# EasyEDA Pro project ESD_System.eprj, schematic Schematic2
Board Name: Base_Board; Create Date: 2026-06-29; Page Name: P1; Project Name: ESD_System; Schematic Name: Schematic2; Update Date: 2026-07-01; Company: EasyEDA.com; Page Size: A4; Version: V1.0
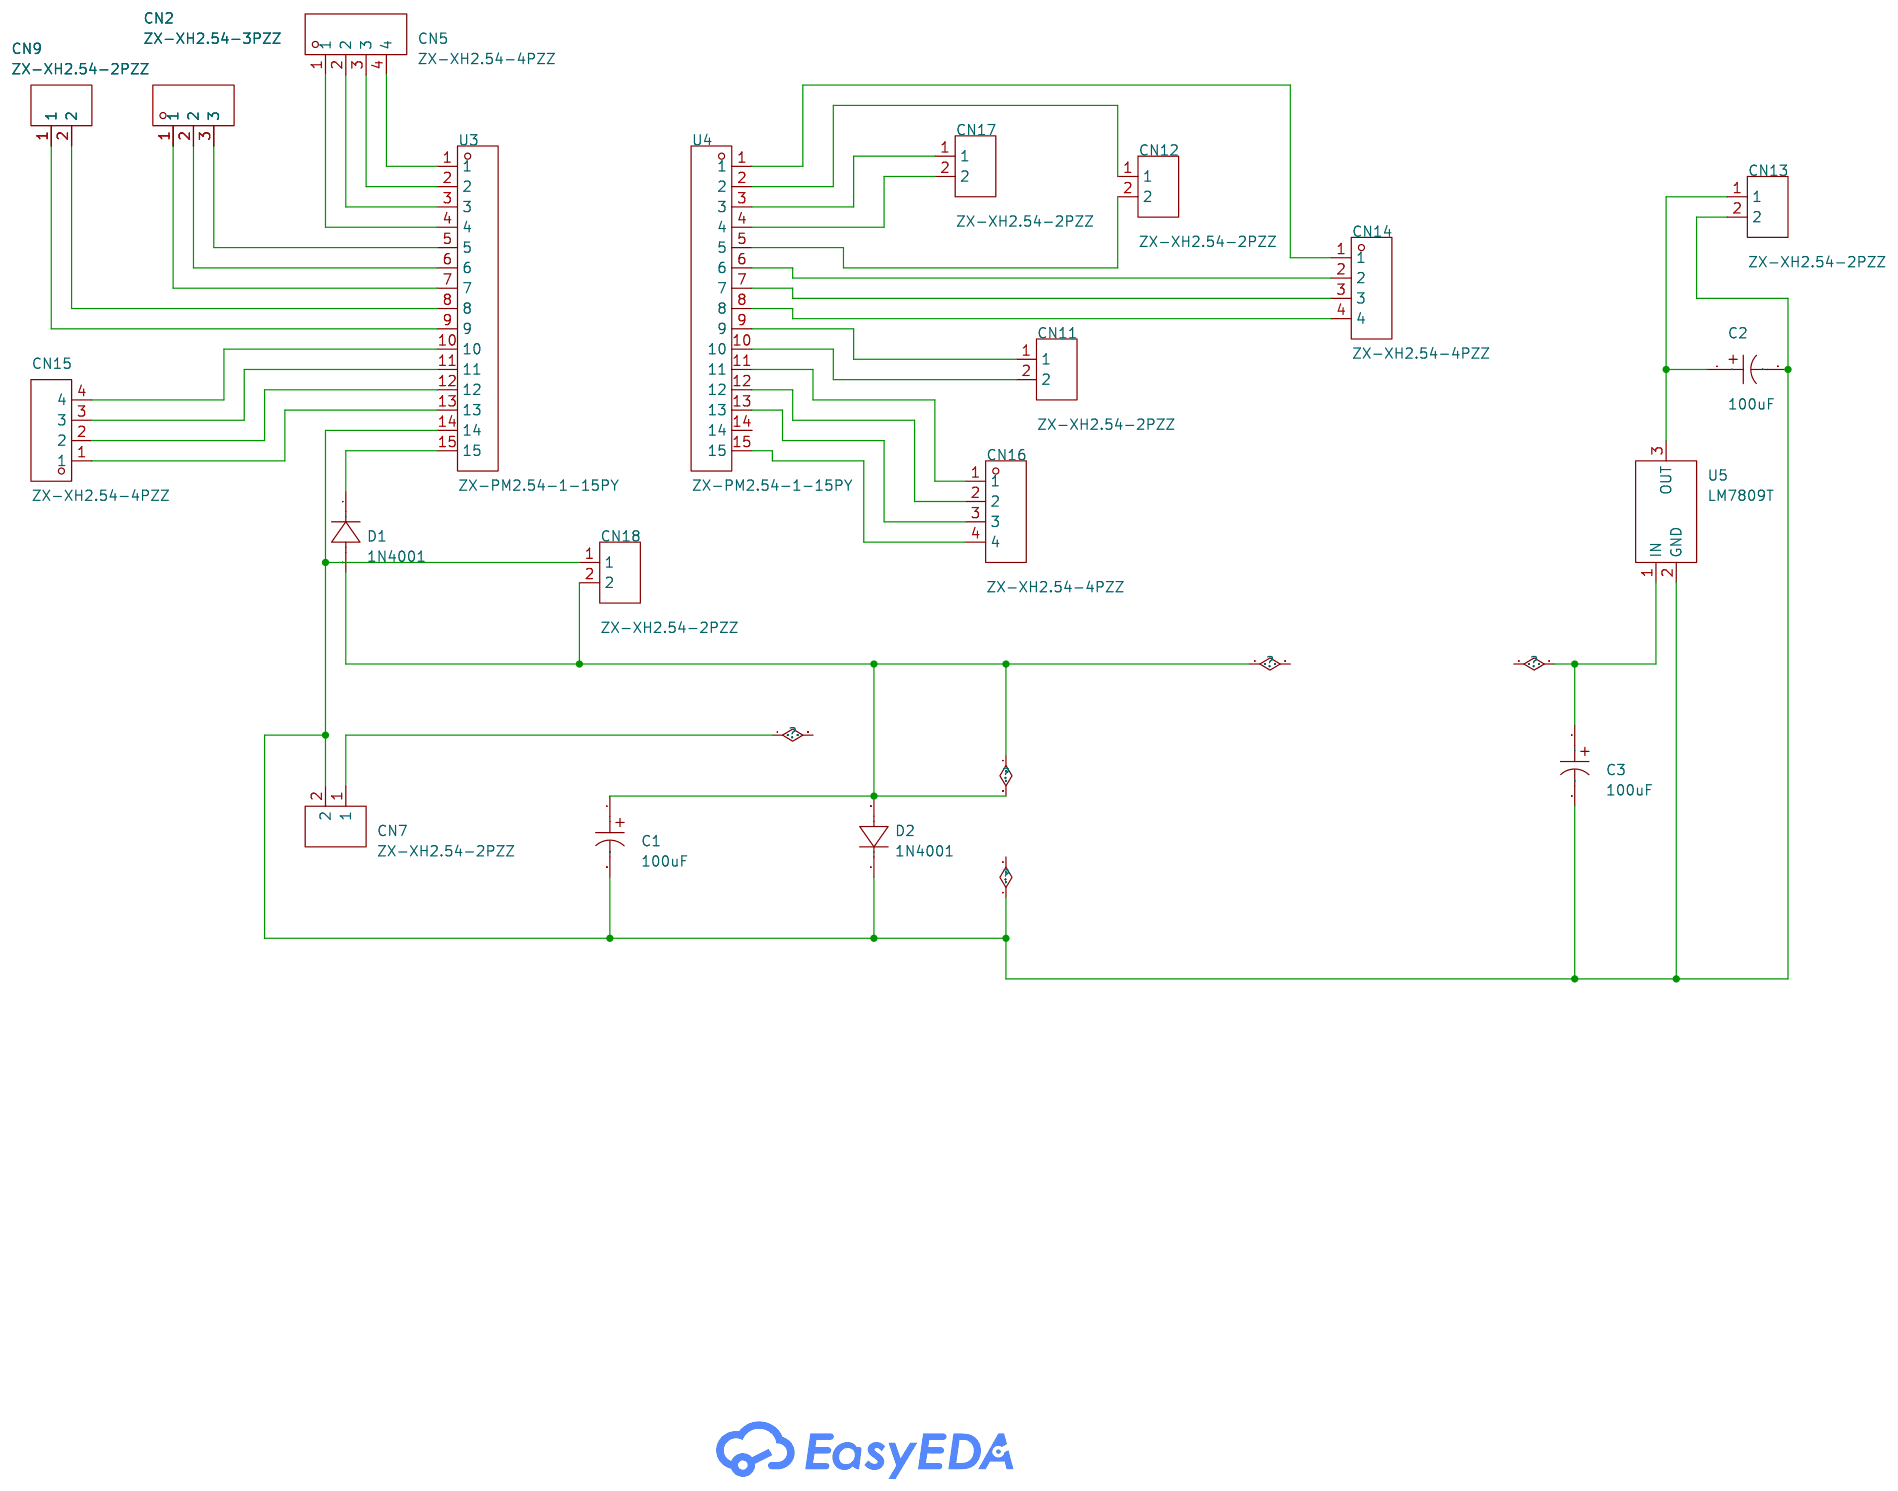
[diagram p1: schematic sheet]

## Parts
C1  100uF  [CAP-TH_BD6.3-P2.50-D0.5-FD]
C2  100uF  [CAP-TH_BD6.3-P2.50-D0.5-FD]
C3  100uF  [CAP-TH_BD6.3-P2.50-D0.5-FD]
CN2  ZX-XH2.54-3PZZ  [CONN-TH_3P-P2.54_2501S-3P]
CN5  ZX-XH2.54-4PZZ  [CONN-TH_4P-P2.50_4PIN]
CN7  ZX-XH2.54-2PZZ  [CONN-TH_2P-P2.50_HX25003-2A]
CN9  ZX-XH2.54-2PZZ  [CONN-TH_2P-P2.50_HX25003-2A]
CN11  ZX-XH2.54-2PZZ  [CONN-TH_2P-P2.50_HX25003-2A]
CN12  ZX-XH2.54-2PZZ  [CONN-TH_2P-P2.50_HX25003-2A]
CN13  ZX-XH2.54-2PZZ  [CONN-TH_2P-P2.50_HX25003-2A]
CN14  ZX-XH2.54-4PZZ  [CONN-TH_4P-P2.50_4PIN]
CN15  ZX-XH2.54-4PZZ  [CONN-TH_4P-P2.50_4PIN]
CN16  ZX-XH2.54-4PZZ  [CONN-TH_4P-P2.50_4PIN]
CN17  ZX-XH2.54-2PZZ  [CONN-TH_2P-P2.50_HX25003-2A]
CN18  ZX-XH2.54-2PZZ  [CONN-TH_2P-P2.50_HX25003-2A]
D1  1N4001  [DO-41_BD2.4-L4.7-P8.70-D0.9-RD]
D2  1N4001  [DO-41_BD2.4-L4.7-P8.70-D0.9-RD]
U3  ZX-PM2.54-1-15PY  [HDR-TH_15P-P2.54-V-F]
U4  ZX-PM2.54-1-15PY  [HDR-TH_15P-P2.54-V-F]
U5  LM7809T  [TO-220-3_L10.0-W4.5-P2.54-L-1]

## Library data of the parts
C1-C3 = ESS107M025AE2AA: Capacitance:100uF Tolerance:±20% Tolerance:±20% Voltage Rating:25V Ripple Current:120mA@120Hz Diameter:6.3mm Height - Seated (Max):7mm Pin Spacing:2.5mm Lifetime:1000hrs@105℃ Operating Temperature:-40℃~+105℃ Operating Temperature:-40℃~+105℃; LCSC Part Name: 100uF ±20% 25V; Supplier Part: C20949818; Manufacturer: KEMET(基美); Supplier Footprint: 插件,P=2.5mm; JLCPCB Part Class: Extended Part; Datasheet: https://item.szlcsc.com/datasheet/ESS107M025AE2AA/22366887.html; Supplier: LCSC; Tolerance: ±20%; Voltage Rating: 25V; Ripple Current: 120mA@120Hz; Diameter: 6.3mm; Height - Seated (Max): 7mm; Pin Spacing: 2.5mm; Lifetime: 1000hrs@105℃; Operating Temperature: -40℃~+105℃
CN2 = ZX-XH2.54-3PZZ: Pins Structure:1x3P Pitch:2.5mm Mounting Type:Through Hole Reference Series:XH Number of Pins:3P Number of Rows:1 Number of PINs Per Row:3 Row Spacing:- Current Rating:3A Contact Material:Brass Contact Plating:Tin Operating Temperature:-25℃~+85℃ Operating; LCSC Part Name: 1x3P 间距:2.5mm 直插 系列:XH; Supplier Part: C7429633; Manufacturer: Megastar(兆星); Supplier Footprint: 插件,P=2.5mm; JLCPCB Part Class: Extended Part; Datasheet: https://item.szlcsc.com/datasheet/ZX-XH2.54-3PZZ/8427550.html; Supplier: LCSC; Pins Structure: 1x3P; Pitch: 2.5mm; Mounting Type: Through Hole; Reference Series: XH; Number of Pins: 3P; Number of Rows: 1; Number of PINs Per Row: 3; Current Rating: 3A; Contact Material: Brass; Contact Plating: Tin; Operating Temperature: -25℃~+85℃; Voltage Rating: 250V; Plastic Material: PA66; Flame Retardant Rating: UL94V-0; Color: White; Z-Height of the Board: 7mm; X-Length of Bottom Edge on Board (Spacing Line): 10mm; Y-Width of Bottom Edge on Board: 5.9mm
CN5 CN14-CN16 = ZX-XH2.54-4PZZ: Pins Structure:1x4P Pitch:2.5mm Mounting Type:Through Hole Reference Series:XH Number of Pins:4P Number of Rows:1 Number of PINs Per Row:4 Row Spacing:- Current Rating:3A Contact Material:Brass Contact Plating:Tin Operating Temperature:-25℃~+85℃ Operating; LCSC Part Name: 1x4P 间距:2.5mm 直插 系列:XH; Supplier Part: C7429634; Manufacturer: Megastar(兆星); Supplier Footprint: 插件,P=2.5mm; JLCPCB Part Class: Extended Part; Datasheet: https://item.szlcsc.com/datasheet/ZX-XH2.54-4PZZ/8427551.html; Supplier: LCSC; Pins Structure: 1x4P; Pitch: 2.5mm; Mounting Type: Through Hole; Reference Series: XH; Number of Pins: 4P; Number of Rows: 1; Number of PINs Per Row: 4; Current Rating: 3A; Contact Material: Brass; Contact Plating: Tin; Operating Temperature: -25℃~+85℃; Voltage Rating: 250V; Plastic Material: PA66; Flame Retardant Rating: UL94V-0; Color: White; Z-Height of the Board: 7mm; X-Length of Bottom Edge on Board (Spacing Line): 12.5mm; Y-Width of Bottom Edge on Board: 5.9mm
CN7 CN9 CN11-CN13 CN17 CN18 = ZX-XH2.54-2PZZ: Pins Structure:1x2P Pitch:2.5mm Mounting Type:Through Hole Reference Series:XH Number of Pins:2P Number of Rows:1 Number of PINs Per Row:2 Row Spacing:- Current Rating:2A Contact Material:Brass Contact Plating:Tin Operating Temperature:-25℃~+85℃ Operating; LCSC Part Name: 1x2P 间距:2.5mm 直插 系列:XH; Supplier Part: C7429632; Manufacturer: Megastar(兆星); Supplier Footprint: 插件,P=2.5mm; JLCPCB Part Class: Extended Part; Datasheet: https://item.szlcsc.com/datasheet/ZX-XH2.54-2PZZ/8427549.html; Supplier: LCSC; Pins Structure: 1x2P; Pitch: 2.5mm; Mounting Type: Through Hole; Reference Series: XH; Number of Pins: 2P; Number of Rows: 1; Number of PINs Per Row: 2; Current Rating: 2A; Contact Material: Brass; Contact Plating: Tin; Operating Temperature: -25℃~+85℃; Voltage Rating: 250V; Plastic Material: PA66; Flame Retardant Rating: UL94V-0; Color: White; Z-Height of the Board: 7mm; X-Length of Bottom Edge on Board (Spacing Line): 7.5mm; Y-Width of Bottom Edge on Board: 5.9mm
D1 D2 = 1N4001_C7544975: Voltage - Forward(Vf@If):1.1V@1.0A Voltage - DC Reverse(Vr):50V Current - Rectified:1A Reverse Leakage Current (Ir):5uA Non-Repetitive Peak Forward Surge Current:30A Operating Junction Temperature Range:-55℃~+150℃ Operating Junction Temperature Range:-55℃; LCSC Part Name: 50V 1A; Supplier Part: C7544975; Manufacturer: LJ(朗捷); Supplier Footprint: DO-41; JLCPCB Part Class: Extended Part; Datasheet: https://item.szlcsc.com/datasheet/1N4001/8655186.html; Supplier: LCSC; Voltage - Forward(Vf@If): 1.1V@1.0A; Voltage - DC Reverse(Vr): 50V; Current - Rectified: 1A; Reverse Leakage Current (Ir): 5uA; Non-Repetitive Peak Forward Surge Current: 30A; Operating Junction Temperature Range: -55℃~+150℃
U3 U4 = ZX-PM2.54-1-15PY: Holes Structure:1x15P Pitch:2.54mm Row Spacing:- Circular Hole / Square Hole:Square Hole Mounting Type:Through Hole Number of Rows:1 Number of Positions:15P Current Rating:3A Voltage Rating (Max):- Holes Direction:Top Insulation Height:8.5mm Contact Mater; LCSC Part Name: 1x15P 间距:2.54mm 直插; Supplier Part: C7499333; Manufacturer: Megastar(兆星); Supplier Footprint: 插件,P=2.54mm; JLCPCB Part Class: Extended Part; Datasheet: https://item.szlcsc.com/datasheet/ZX-PM2.54-1-15PY/8573994.html; Supplier: LCSC; Holes Structure: 1x15P; Pitch: 2.54mm; Circular Hole / Square Hole: Square Hole; Mounting Type: Through Hole; Number of Rows: 1; Number of Positions: 15P; Current Rating: 3A; Holes Direction: Top; Insulation Height: 8.5mm; Contact Material: Brass; Contact Plating: Gold; Operating Temperature: -40℃~+105℃; PIN Length: 3.2mm
U5 = LM7809T_C32424245: Output Configuration:Positive Voltage - Supply:35V Output Voltage:9V Output Voltage:9V Output Current:1.5A Power Supply Rejection Ratio (PSRR):- Voltage Dropout:2V@(1A) standby current:- Noise:- Features:- Operating Temperature:-40℃~+125℃ Operating Temper; LCSC Part Name: 9V 1.5A 35V; Supplier Part: C32424245; Manufacturer: HTC; Supplier Footprint: TO-220-3L; JLCPCB Part Class: Extended Part; Datasheet: https://item.szlcsc.com/datasheet/LM7809T/34157171.html; Supplier: LCSC; Output Configuration: Positive; Voltage - Supply: 35V; Output Voltage: 9V; Output Current: 1.5A; Voltage Dropout: 2V@(1A); Operating Temperature: -40℃~+125℃; Output Type: Fixed; Number of Outputs: 1

## Nets
$1N1149: CN17.2 U4.4
$1N1153: CN16.2 U4.12
$1N1159: CN16.3 U4.13
$1N1165: CN16.4 U4.15
$1N1171: CN16.1 U4.11
$1N1177: CN12.2 U4.5
$1N1182: CN17.1 U4.3
$1N1186: CN14.1 U4.1
$1N1192: CN12.1 U4.2
$1N1197: CN11.1 U4.9
$1N1201: CN11.2 U4.10
$1N1205: CN14.3 U4.7
$1N1209: CN14.4 U4.8
$1N1213: CN14.2 U4.6
$1N1217: CN15.2 U3.12
$1N1221: CN2.1 U3.7
$1N1224: CN15.4 U3.10
$1N1228: CN15.3 U3.11
$1N1232: CN15.1 U3.13
$1N1236: C1.2 C2.2 C3.2 CN7.2 CN13.2 CN18.1 D2.1(K) U3.14 U5.2(GND)
$1N1255: CN2.3 U3.5
$1N1258: CN2.2 U3.6
$1N1261: CN5.1 U3.4
$1N1264: CN5.4 U3.1
$1N1267: CN5.3 U3.2
$1N1270: CN5.2 U3.3
$1N1273: CN9.2 U3.8
$1N1276: CN9.1 U3.9
$1N1282: C1.1 CN18.2 D1.2(A) D2.2(A)
$1N1294: D1.1(K) U3.15
$1N1297: C3.1 U5.1(IN)
$1N1300: C2.1 CN13.1 U5.3(OUT)

Not connected (* = marked no-connect by the designer): CN7 1; U4 14
